# EAGLE design Pixel-X_Display_v1_sk6812b-mini-3535 (EAGLE 7.7.0)
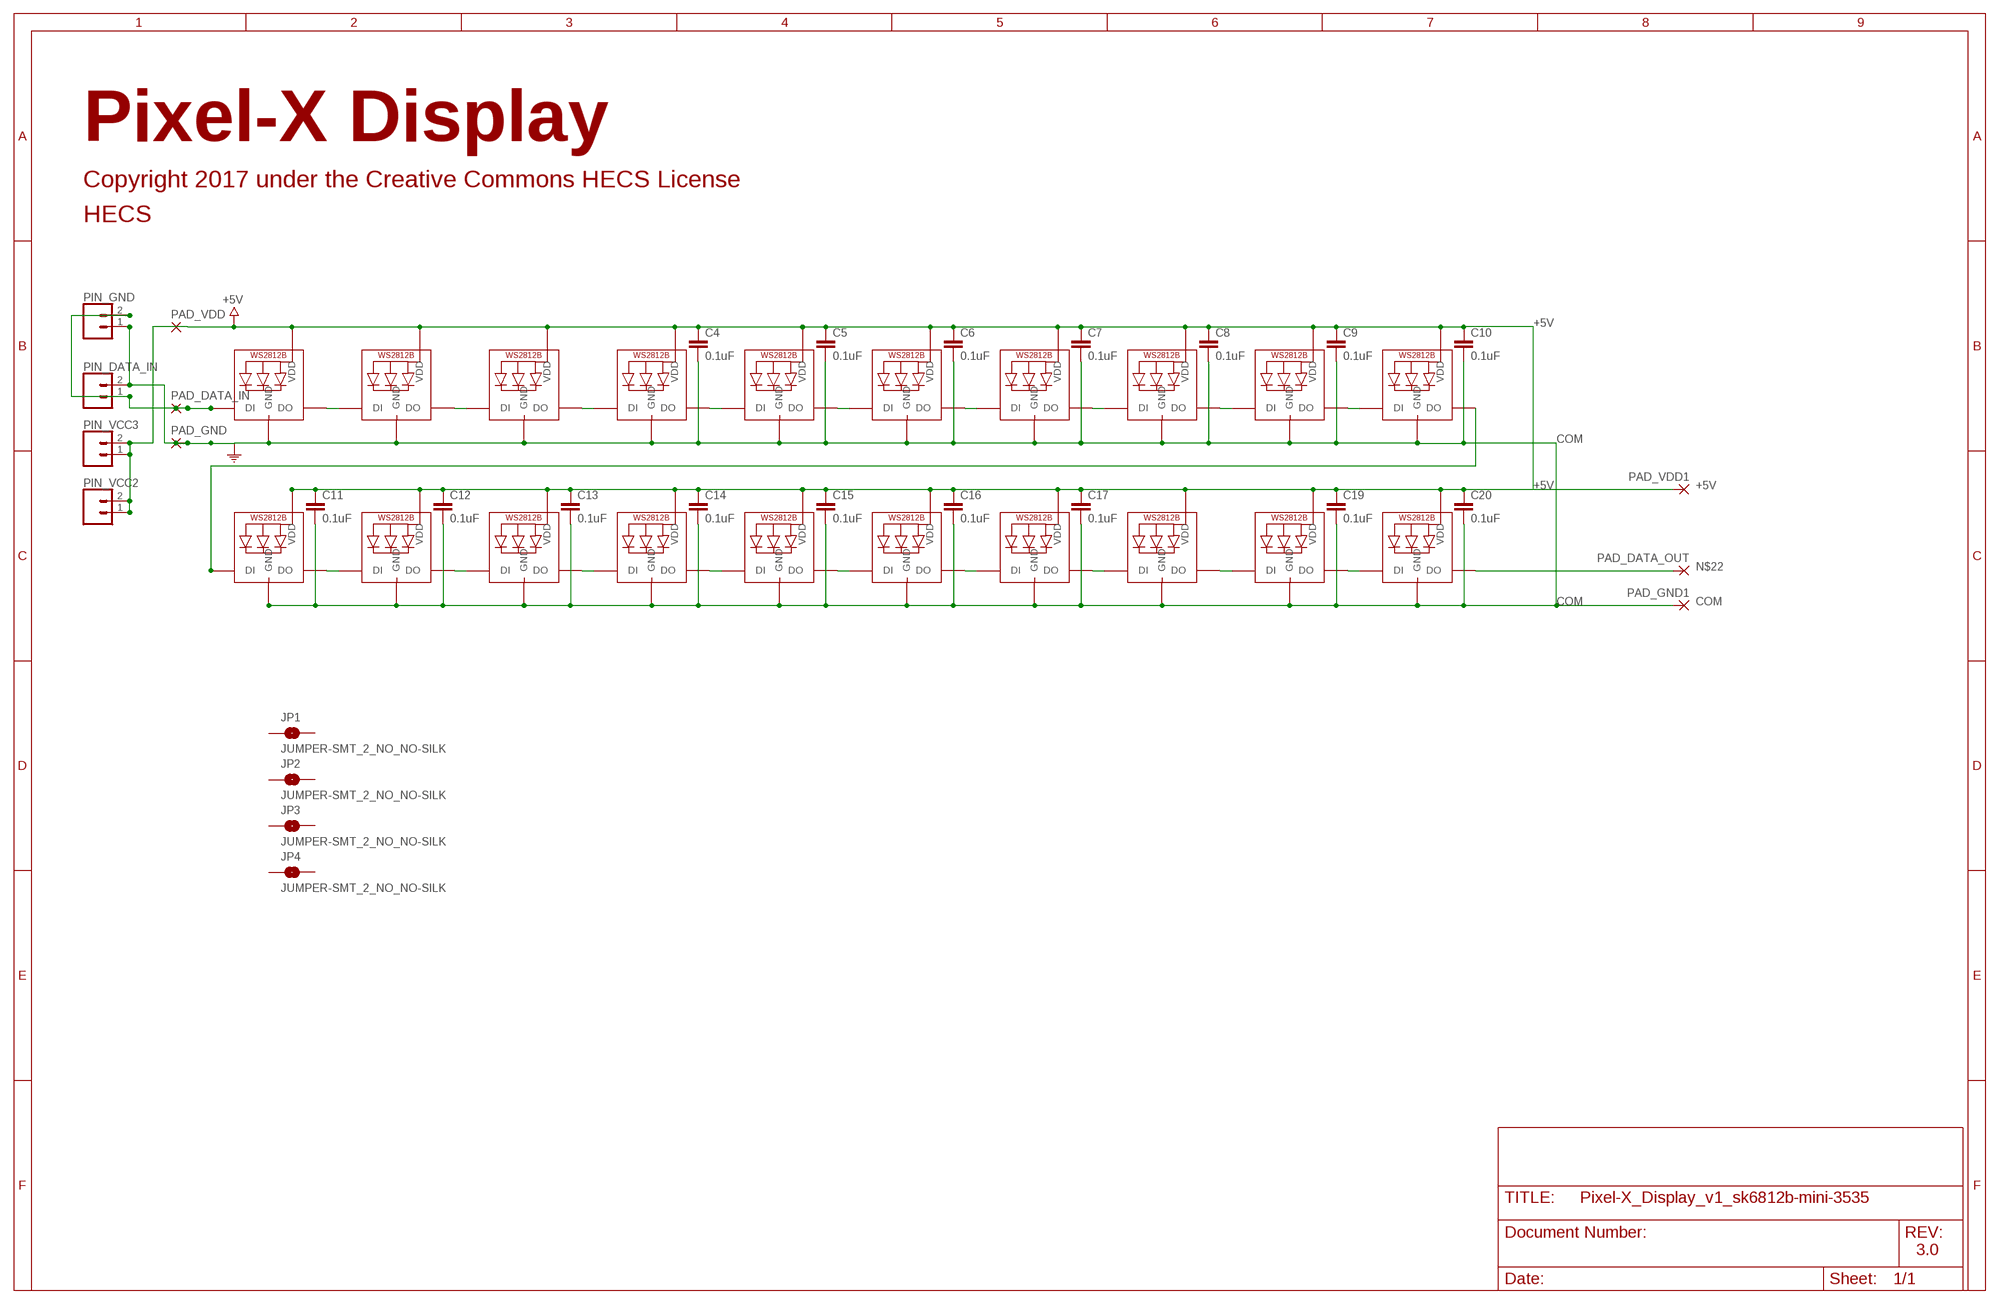
[diagram p0: schematic, sheet 1]

## Parts
C4  0.1uF  0.1UF-0603-25V-(+80/-20%)  [0603]
C5  0.1uF  0.1UF-0603-25V-(+80/-20%)  [0603]
C6  0.1uF  0.1UF-0603-25V-(+80/-20%)  [0603]
C7  0.1uF  0.1UF-0603-25V-(+80/-20%)  [0603]
C8  0.1uF  0.1UF-0603-25V-(+80/-20%)  [0603]
C9  0.1uF  0.1UF-0603-25V-(+80/-20%)  [0603]
C10  0.1uF  0.1UF-0603-25V-(+80/-20%)  [0603]
C11  0.1uF  0.1UF-0603-25V-(+80/-20%)  [0603]
C12  0.1uF  0.1UF-0603-25V-(+80/-20%)  [0603]
C13  0.1uF  0.1UF-0603-25V-(+80/-20%)  [0603]
C14  0.1uF  0.1UF-0603-25V-(+80/-20%)  [0603]
C15  0.1uF  0.1UF-0603-25V-(+80/-20%)  [0603]
C16  0.1uF  0.1UF-0603-25V-(+80/-20%)  [0603]
C17  0.1uF  0.1UF-0603-25V-(+80/-20%)  [0603]
C19  0.1uF  0.1UF-0603-25V-(+80/-20%)  [0603]
C20  0.1uF  0.1UF-0603-25V-(+80/-20%)  [0603]
JP1  JUMPER-SMT_2_NO_NO-SILK  [SMT-JUMPER_2_NO_NO-SILK]
JP2  JUMPER-SMT_2_NO_NO-SILK  [SMT-JUMPER_2_NO_NO-SILK]
JP3  JUMPER-SMT_2_NO_NO-SILK  [SMT-JUMPER_2_NO_NO-SILK]
JP4  JUMPER-SMT_2_NO_NO-SILK  [SMT-JUMPER_2_NO_NO-SILK]
LED1  WS2812B3535  [LED3535]
LED2  WS2812B3535  [LED3535]
LED3  WS2812B3535  [LED3535]
LED4  WS2812B3535  [LED3535]
LED5  WS2812B3535  [LED3535]
LED6  WS2812B3535  [LED3535]
LED7  WS2812B3535  [LED3535]
LED8  WS2812B3535  [LED3535]
LED9  WS2812B3535  [LED3535]
LED10  WS2812B3535  [LED3535]
LED11  WS2812B3535  [LED3535]
LED12  WS2812B3535  [LED3535]
LED13  WS2812B3535  [LED3535]
LED14  WS2812B3535  [LED3535]
LED15  WS2812B3535  [LED3535]
LED16  WS2812B3535  [LED3535]
LED17  WS2812B3535  [LED3535]
LED18  WS2812B3535  [LED3535]
LED19  WS2812B3535  [LED3535]
LED20  WS2812B3535  [LED3535]
PAD_DATA_IN  SMD5  [SMD2,54-5,08]
PAD_DATA_OUT  SMD5  [SMD2,54-5,08]
PAD_GND  SMD5  [SMD2,54-5,08]
PAD_GND1  SMD5  [SMD2,54-5,08]
PAD_VDD  SMD5  [SMD2,54-5,08]
PAD_VDD1  SMD5  [SMD2,54-5,08]
PIN_DATA_IN  CONN_02  [1X02]
PIN_GND  CONN_02  [1X02]
PIN_VCC2  CONN_02  [1X02]
PIN_VCC3  CONN_02  [1X02]

## Nets
+5V: C4.1 C5.1 C6.1 C7.1 C8.1 C9.1 C10.1 C11.1 C12.1 C13.1 C14.1 C15.1 C16.1 C17.1 C19.1 C20.1 LED1.2(VDD) LED2.2(VDD) LED3.2(VDD) LED4.2(VDD) LED5.2(VDD) LED6.2(VDD) LED7.2(VDD) LED8.2(VDD) LED9.2(VDD) LED10.2(VDD) LED11.2(VDD) LED12.2(VDD) LED13.2(VDD) LED14.2(VDD) LED15.2(VDD) LED16.2(VDD) LED17.2(VDD) LED18.2(VDD) LED19.2(VDD) LED20.2(VDD) PAD_VDD1.1(P) PAD_VDD.1(P) PIN_VCC2.1 PIN_VCC2.2 PIN_VCC3.1 PIN_VCC3.2
COM: C4.2 C5.2 C6.2 C7.2 C8.2 C9.2 C10.2 C11.2 C12.2 C13.2 C14.2 C15.2 C16.2 C17.2 C19.2 C20.2 LED1.4(GND) LED2.4(GND) LED3.4(GND) LED4.4(GND) LED5.4(GND) LED6.4(GND) LED7.4(GND) LED8.4(GND) LED9.4(GND) LED10.4(GND) LED11.4(GND) LED12.4(GND) LED13.4(GND) LED14.4(GND) LED15.4(GND) LED16.4(GND) LED17.4(GND) LED18.4(GND) LED19.4(GND) LED20.4(GND) PAD_GND1.1(P) PAD_GND.1(P) PIN_DATA_IN.2 PIN_GND.1
N$1: LED1.1(DI) PAD_DATA_IN.1(P) PIN_DATA_IN.1 PIN_GND.2
N$2: LED1.3(DO) LED2.1(DI)
N$3: LED2.3(DO) LED3.1(DI)
N$4: LED3.3(DO) LED4.1(DI)
N$5: LED4.3(DO) LED5.1(DI)
N$6: LED5.3(DO) LED6.1(DI)
N$8: LED6.3(DO) LED7.1(DI)
N$9: LED7.3(DO) LED8.1(DI)
N$10: LED8.3(DO) LED9.1(DI)
N$11: LED9.3(DO) LED10.1(DI)
N$12: LED10.3(DO) LED11.1(DI)
N$13: LED11.3(DO) LED12.1(DI)
N$14: LED12.3(DO) LED13.1(DI)
N$15: LED13.3(DO) LED14.1(DI)
N$16: LED15.3(DO) LED16.1(DI)
N$17: LED16.3(DO) LED17.1(DI)
N$18: LED17.3(DO) LED18.1(DI)
N$19: LED18.3(DO) LED19.1(DI)
N$20: LED19.3(DO) LED20.1(DI)
N$21: LED14.3(DO) LED15.1(DI)
N$22: LED20.3(DO) PAD_DATA_OUT.1(P)
Unconnected: JP1.1 JP1.2 JP2.1 JP2.2 JP3.1 JP3.2 JP4.1 JP4.2

## Notes on the sheet
- Pixel-X Display
- Copyright 2017 under the Creative Commons HECS License
- HECS
- 3.0

## Library data of the parts
C4-C17 C19 C20 = SparkFun-Capacitors:0.1UF: 0.1µF ceramic capacitors A capacitor is a passive two-terminal electrical component used to store electrical energy temporarily in an electric field.; PROD_ID: CAP-00810
JP1-JP4 = SparkFun-Jumpers:JUMPER-SMT_2_NO: Normally open jumper This jumper has two pads in close proximity to each other. Apply solder to close the connection. Round pads are easier to solder for beginners, but are a lot larger. SparkFun Product that uses the round pads: SparkFun EL Sequencer <https://www.sparkfun.com/products/12781>
LED1-LED20 = SK6812b_footprint extend:WS2812B
PAD_DATA_IN PAD_DATA_OUT PAD_GND PAD_GND1 PAD_VDD PAD_VDD1 = wirepad:SMD5: SMD PAD
PIN_DATA_IN PIN_GND PIN_VCC2 PIN_VCC3 = SparkFun-Connectors:CONN_02: Multi connection point. Often used as Generic Header-pin footprint for 0.1 inch spaced/style header connections On any of the 0.1 inch spaced packages, you can populate with these: Break Away Headers - Straight <https://www.sparkfun.com/products/116> (PRT-00116) Break Away Male Headers - Right Angle <https://www.sparkfun.com/products/553> (PRT-00553) Female Headers <https://www.sparkfun.com/products/115> (PRT-00115) Break Away Headers - Machine Pin <https://www.sparkfun.com/products/117> (PRT-00117) Break Away Female Headers - Swiss Machine Pin <https://www.sparkfun.com/products/743> (PRT-00743) For SCREWTERMINALS and SPRING TERMINALS visit here: Screw Terimnals on SparkFun.com <https://www.sparkfun.com/search/results?term=Screw+Terminals> (5mm/3.5mm/2.54mm spacing) This device is also useful as a general connection point to wire up your design to another part of your project. Our various solder wires solder well into these plated through hole pads. Hook-Up Wire - Assortment (Stranded, 22 AWG) <https://www.sparkfun.com/products/11375> (PRT-11375) Hook-Up Wire - Assortment (Solid Core, 22 AWG) <https://www.sparkfun.com/products/11367> (PRT-11367) View the entire wire category on our website here <https://www.sparkfun.com/categories/141> Special notes: Molex polarized connector foot print use with: PRT-08233 with associated crimp pins and housings. 2.54_SCREWTERM for use with PRT-10571. 3.5mm Screw Terminal footprints for PRT-08084 5mm Screw Terminal footprints for use with PRT-08432

## Board
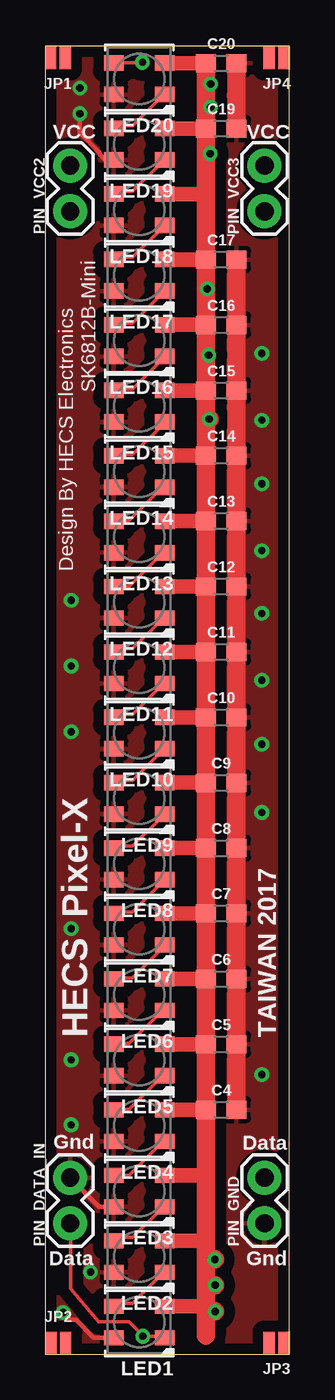
[diagram p1: board, top side]
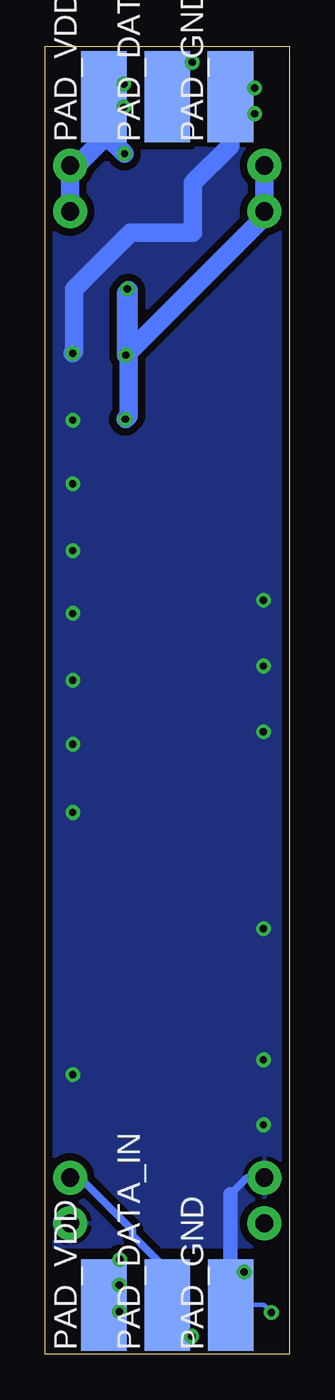
[diagram p2: board, bottom side, seen from below]

Size 13.6 x 72.69 mm. Coordinates in mm from the lower left corner, seen from the top.
Outline: 0,0 13.6,0 13.6,72.69 0,72.69 0,0
Copper layers (1*16): Top 0.035mm / dielectric 1.5mm / Bottom 0.035mm
Design rules "default *": minimum track width 8mil, minimum drill 16mil, track to track 8mil, track to pad 8mil, pad to pad 8mil, via to via 8mil, smd to smd 8mil, copper to edge 8mil, drill to drill 8mil, minimum pad ring 12mil, minimum via ring 8mil, stop-mask expansion 4mil, vias tented up to drill 18mil, thermal gap 10mil

### Footprints (pad centres in the part's own frame; a part is rotated, then mirrored left to right if it is on the bottom)
0603 = smd 1.1 x 1: 1 -0.85,0; 2 0.85,0
SMT-JUMPER_2_NO_NO-SILK = smd 0.635 x 1.27: 1 -0.406,0; 2 0.406,0
LED3535 = smd 1.1 x 0.85: 1 -1.414,0.875; 2 -1.414,-0.875; 3 1.414,-0.875; 4 1.414,0.875
SMD2,54-5,08 = smd 2.54 x 5.08: 1 0,0
1X02 = drill 1.016 pad 1.88: 1 0,0; 2 2.54,0

### Placement (x,y rotation side)
C4  9.8,13.59 0 top
C5  9.8,17.23 0 top
C6  9.8,20.86 0 top
C7  9.8,24.51 0 top
C8  9.8,28.13 0 top
C9  9.8,31.76 0 top
C10  9.8,35.4 0 top
C11  9.8,39.04 0 top
C12  9.8,42.67 0 top
C13  9.8,46.31 0 top
C14  9.8,49.94 0 top
C15  9.8,53.55 0 top
C16  9.8,57.19 0 top
C17  9.8,60.83 0 top
C19  9.8,68.11 0 top
C20  9.8,71.74 0 top
JP1  0.72,72.04 180 top
JP2  0.74,0.64 0 top
JP3  12.88,0.64 180 top
JP4  12.88,72.04 180 top
LED1  5.24,1.81 180 top
LED2  5.24,5.44 180 top
LED3  5.24,9.08 180 top
LED4  5.24,12.72 180 top
LED5  5.24,16.36 180 top
LED6  5.24,19.99 180 top
LED7  5.24,23.63 180 top
LED8  5.24,27.26 180 top
LED9  5.24,30.89 180 top
LED10  5.24,34.52 180 top
LED11  5.24,38.16 180 top
LED12  5.24,41.79 180 top
LED13  5.24,45.42 180 top
LED14  5.24,49.06 180 top
LED15  5.24,52.69 180 top
LED16  5.24,56.33 180 top
LED17  5.24,59.96 180 top
LED18  5.24,63.6 180 top
LED19  5.24,67.23 180 top
LED20  5.24,70.87 180 top
PAD_DATA_IN  6.8,2.75 0 bottom
PAD_DATA_OUT  6.8,69.88 0 bottom
PAD_GND  3.27,2.76 0 bottom
PAD_GND1  3.29,69.88 0 bottom
PAD_VDD  10.32,2.76 0 bottom
PAD_VDD1  10.32,69.88 0 bottom
PIN_DATA_IN  1.4,7.28 90 top
PIN_GND  12.21,7.28 90 top
PIN_VCC2  1.4,63.51 90 top
PIN_VCC3  12.21,63.51 90 top

### Tracks (layer width: path | path; a pad name or v marks a point on that pad's centre or on a via)
+5V  (via drill 0.41)
  Top 0.203: v9.18,66.71 8.95,66.7 | v9.22,69.3 9,69.36 8.95,69.5 | 8.95,71 9,71 v9.22,70.58 | 8.95,10.2 8.95,10.5 | v9.03,59.2 9.14,59.33 8.95,59.31
  Top 0.813: 8.95,0.94 8.95,1.06 | 8.95,4.58 8.95,4.62 | 8.95,8.22 | 8.95,11.86 8.95,11.83 | 8.95,15.5 8.95,15.6 | 8.95,19.15 8.95,19.23 | 8.95,22.8 8.95,22.65 | 8.95,26.45 8.95,26.52 | 8.95,30.09 8.95,30.3 | 8.95,33.74 8.95,33.58 | 8.95,37.39 8.95,37.38 | 8.95,41.03 8.95,41.1 | 8.95,44.68 8.95,44.8 | 8.95,48.33 8.95,48.45 | 8.95,51.98 8.95,52.08 | 8.95,55.62 8.95,55.63 | 8.95,59.27 8.95,59.31 | 8.95,62.91 8.95,63.03 | 8.95,66.55 8.95,66.7 | 8.95,70.19 8.95,70.17 | LED1.2 8.95,2.68 8.95,2.72 | LED2.2 8.95,6.32 8.95,6.28 | LED3.2 8.79,9.96 8.95,10.2 | LED4.2 C4.1 | LED5.2 C5.1 | LED6.2 C6.1 | LED7.2 C7.1 | LED8.2 C8.1 | LED9.2 C9.1 | LED10.2 C10.1 | LED11.2 C11.1 | LED12.2 C12.1 | LED13.2 8.95,46.3 C13.1 | LED14.2 C14.1 | LED15.2 8.95,53.56 C15.1 | LED16.2 8.95,57.2 C16.1 | LED17.2 C17.1 | LED18.2 8.95,64.47 8.95,64.36 | LED19.2 C19.1 | LED20.2 C20.1
  Top 1.016: C20.1 8.95,71 8.95,70.17 8.95,69.5 C19.1 8.95,66.7 8.95,64.36 8.95,63.03 C17.1 8.95,59.31 C16.1 8.95,55.63 C15.1 8.95,52.08 | 8.95,52.08 C14.1 8.95,48.45 C13.1 8.95,44.8 C12.1 8.95,41.1 C11.1 8.95,37.38 C10.1 8.95,33.58 C9.1 8.95,30.3 C8.1 8.95,26.52 C7.1 8.95,22.65 C6.1 8.95,19.23 C5.1 | C5.1 C4.1 | C5.1 8.95,17.27 8.95,15.6 8.95,11.83 8.95,10.5 8.95,8.22 8.95,6.28 8.95,5.11 | 8.95,5.11 8.95,4.62 8.95,3.83 | 8.95,3.83 8.95,2.72 8.95,2.42 | 8.95,2.42 8.95,1.06 | v9.45,5.28 9.12,5.28 8.95,5.11 | v9.46,3.86 8.98,3.86 8.95,3.83 | v9.46,2.4 8.97,2.4 8.95,2.42 | 8.95,52.08 9.01,52.08 v9.13,51.96
  Bottom 0.203: 10.16,67.67 10.16,67.74 10.16,70.1 PAD_VDD1.1 | PAD_VDD.1 10.16,2.64 9.75,2.64 9.55,2.44 v9.46,2.4
  Bottom 1.016: v9.18,66.71 10.16,67.67 | 10.16,67.74 11.85,66.05 PIN_VCC3.2 PIN_VCC3.1 | PIN_VCC2.1 PIN_VCC2.2 1.4,63.22 v9.1,55.52 9.1,58.98 8.95,59.13 8.95,52.15 v9.13,51.96
COM  (via drill 0.41)
  Top 0.203: LED20.4 3.86,70.1 3.91,70.08
  Top 0.254: LED3.4 3.02,8.21 PIN_DATA_IN.2 | LED1.4 2.71,0.93 1.72,1.92 1.43,1.92 v1.01,2.34 | LED19.4 3.36,66.36 3.04,66.68 3.04,66.78 1.92,67.9 1.92,68.92 v1.94,68.94
  Top 1.016: C20.2 C19.2 | C17.2 C16.2 C15.2 C14.2 C13.2 C12.2 C11.2 C10.2 C9.2 C8.2 C7.2 C6.2 C5.2 C4.2
  Bottom 0.203: 3.29,3 PAD_GND.1
  Bottom 0.254: PAD_GND.1 1.43,2.76 v1.01,2.34 | 3.29,3 3.29,3.97 v2.53,4.58 | 3.29,67.17 3.29,67.59 v1.94,68.94
  Bottom 0.406: 3.29,8.91 2.38,9.82 PIN_DATA_IN.2
  Bottom 0.813: 3.29,3 3.29,8.91
  Bottom 1.016: PAD_GND1.1 3.29,67.17 5.36,65.09 5.36,62.32 8.84,62.32 11.98,59.19 11.98,55.71 v12.06,55.63
  other vias: 12.06,51.91 12.06,48.38 12.06,44.66 12.06,41.17 12.06,37.45 12.06,33.91 12.06,30.11 12.06,15.54 1.45,41.91 1.45,38.25 1.45,34.59 1.45,23.66 1.45,16.37 1.45,12.76 1.94,70.36
  pour Top (isolate 0.61): 0.25,0.25 0.25,72.44 13.35,72.44 13.35,0.25
  pour Bottom (isolate 0.406): 0.25,6 0.25,67 13.35,67 13.35,6
N$1  (via drill 0.41)
  Top 0.203: LED1.1 6.5,1.02 5.69,1.02 v5.44,1.01 5.49,1.02 4.67,1.83 2.99,1.83 1.42,3.66 1.42,7.11 PIN_DATA_IN.1
  Bottom 0.203: 12.19,9.75 PIN_GND.2 | 6.7,4.6 PAD_DATA_IN.1 6.71,2.64 5.69,1.63 5.69,1.02 v5.44,1.01
  Bottom 0.406: 12.19,9.75 11.58,9.75 8.74,6.91 8.73,6.63 6.7,4.6
N$2
  Top 0.203: LED1.3 3.86,2.85 4.88,2.85 6.5,4.47 LED2.1
N$3
  Top 0.203: LED2.3 3.86,6.5 4.88,6.5 6.5,8.13 LED3.1
N$4
  Top 0.203: LED3.3 3.86,9.96 4.67,9.96 6.5,11.79 LED4.1
N$5
  Top 0.203: LED4.3 3.86,13.61 4.67,13.61 6.5,15.44 LED5.1
N$6
  Top 0.203: LED5.3 3.86,17.27 4.67,17.27 6.5,19.1 LED6.1
N$8
  Top 0.203: LED6.3 3.86,20.93 4.88,20.93 6.5,22.55 LED7.1
N$9
  Top 0.203: LED7.3 3.86,24.59 4.88,24.59 6.5,26.21 LED8.1
N$10
  Top 0.203: LED8.3 3.86,28.25 4.88,28.25 6.5,29.87 LED9.1
N$11
  Top 0.203: LED9.3 3.86,31.9 4.88,31.9 6.5,33.53 LED10.1
N$12
  Top 0.203: LED10.3 3.86,35.56 4.88,35.56 6.5,37.19 LED11.1
N$13
  Top 0.203: LED11.3 3.86,39.22 4.88,39.22 6.5,40.84 LED12.1
N$14
  Top 0.203: LED12.3 3.86,42.67 4.67,42.67 6.5,44.5 LED13.1
N$15
  Top 0.203: LED13.3 3.86,46.33 4.67,46.33 6.5,48.16 LED14.1
N$16
  Top 0.203: LED15.3 3.86,53.65 4.88,53.65 6.5,55.27 LED16.1
N$17
  Top 0.203: LED16.3 3.86,57.3 4.88,57.3 6.5,58.93 LED17.1
N$18
  Top 0.203: LED17.3 3.86,60.96 4.88,60.96 6.5,62.59 LED18.1
N$19
  Top 0.203: LED18.3 3.86,64.62 4.88,64.62 6.5,66.24 LED19.1
N$20
  Top 0.203: LED19.3 3.86,68.28 4.88,68.28 6.5,69.9 LED20.1
N$21
  Top 0.203: LED14.3 3.86,49.99 4.88,49.99 6.5,51.61 LED15.1
N$22  (via drill 0.41)
  Top 0.203: 5.54,71.73 5.43,71.75 v5.42,71.79 5.53,71.77 3.86,71.77 LED20.3
  Bottom 0.203: v5.42,71.79 5.78,71.78 6.75,70 PAD_DATA_OUT.1

### Text on the board
tPlace: VCC | VCC | SK6812B-Mini | Design By HECS Electronics | HECS Pixel-X | TAIWAN 2017 | Gnd | Data | Data | Gnd